# EAGLE design 1s (EAGLE 9.1.1)
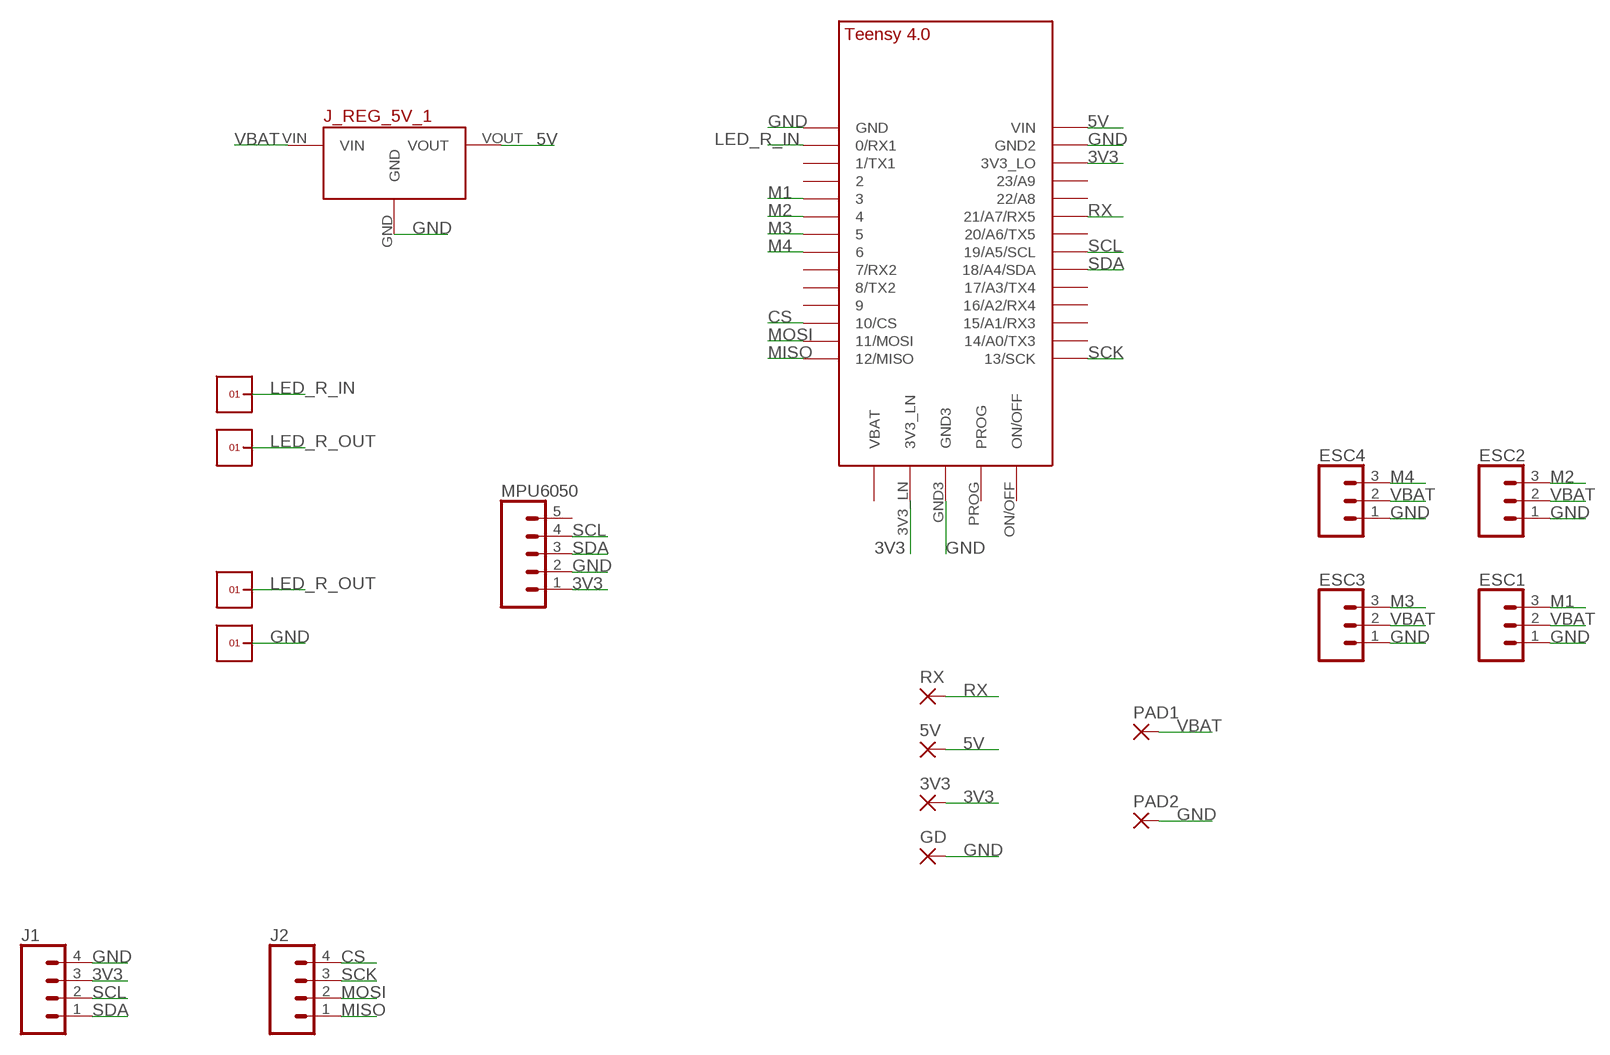
[diagram p0: schematic, sheet 1]

## Parts
3V3  SMD2  [SMD1,27-2,54]
5V  SMD2  [SMD1,27-2,54]
ESC1  455-1750-1-ND  CONN_03  [1X03]
ESC2  455-1750-1-ND  CONN_03  [1X03]
ESC3  455-1750-1-ND  CONN_03  [1X03]
ESC4  455-1750-1-ND  CONN_03  [1X03]
GD  SMD2  [SMD1,27-2,54]
J1  CONN_041X04_NO_SILK  [1X04_NO_SILK]
J2  CONN_041X04_NO_SILK  [1X04_NO_SILK]
J_REG_5V_1  5V_VOLTAGE_REGULATOR  [5V_VOLTAGE_REGULATOR]
MPU6050  CONN_05NO_SILK  [1X05_NO_SILK]
PAD1  SMD5  [SMD2,54-5,08]
PAD2  SMD5  [SMD2,54-5,08]
RX  SMD2  [SMD1,27-2,54]
U$1  TEENSY_4.0  [TEENSY_4.0]
U$3  1X1  [1X1]
U$4  1X1  [1X1]
U$6  1X1  [1X1]
U$7  1X1  [1X1]

## Nets
3V3: 3V3.1(P) J1.3 MPU6050.1 U$1.3V3_LN U$1.3V3_LO
5V: 5V.1(P) J_REG_5V_1.VOUT U$1.VIN
CS: J2.4 U$1.10/CS
GND: ESC1.1 ESC2.1 ESC3.1 ESC4.1 GD.1(P) J1.4 J_REG_5V_1.GND MPU6050.2 PAD2.1(P) U$1.GND U$1.GND2 U$1.GND3 U$7.1
LED_R_IN: U$1.0/RX(0/RX1) U$3.1
LED_R_OUT: U$4.1 U$6.1
M1: ESC1.3 U$1.3/CANTX
M2: ESC2.3 U$1.4/CANRX
M3: ESC3.3 U$1.5
M4: ESC4.3 U$1.6
MISO: J2.1 U$1.12/MISO
MOSI: J2.2 U$1.11/MOSI
RX: RX.1(P) U$1.21/A7(21/A7/RX5)
SCK: J2.3 U$1.13/SCK
SCL: J1.2 MPU6050.4 U$1.19/A5/SCL
SDA: J1.1 MPU6050.3 U$1.18/A4/SDA
VBAT: ESC1.2 ESC2.2 ESC3.2 ESC4.2 J_REG_5V_1.VIN PAD1.1(P)
Unconnected: MPU6050.5 U$1.1/TX(1/TX1) U$1.2 U$1.7(7/RX2) U$1.8(8/TX2) U$1.9/CS U$1.14/A0(14/A0/TX3) U$1.15/A1(15/A1/RX3) U$1.16/A2(16/A2/RX4) U$1.17/A3(17/A3/TX4) U$1.20/A6(20/A6/TX5) U$1.22/A8 U$1.23/A9 U$1.ON/OFF U$1.PROG U$1.VBAT\(VBAT)

## Library data of the parts
3V3 5V GD RX = wirepad:SMD2: SMD PAD
ESC1-ESC4 = SparkFun-Connectors:CONN_03: Multi connection point. Often used as Generic Header-pin footprint for 0.1 inch spaced/style header connections On any of the 0.1 inch spaced packages, you can populate with these: Break Away Headers - Straight <https://www.sparkfun.com/products/116> (PRT-00116) Break Away Male Headers - Right Angle <https://www.sparkfun.com/products/553> (PRT-00553) Female Headers <https://www.sparkfun.com/products/115> (PRT-00115) Break Away Headers - Machine Pin <https://www.sparkfun.com/products/117> (PRT-00117) Break Away Female Headers - Swiss Machine Pin <https://www.sparkfun.com/products/743> (PRT-00743) Stackable Header - 3 Pin (Female, 0.1") <https://www.sparkfun.com/products/13875> (PRT-13875) For SCREWTERMINALS and SPRING TERMINALS visit here: Screw Terimnals on SparkFun.com <https://www.sparkfun.com/search/results?term=Screw+Terminals> (5mm/3.5mm/2.54mm spacing) This device is also useful as a general connection point to wire up your design to another part of your project. Our various solder wires solder well into these plated through hole pads. Hook-Up Wire - Assortment (Stranded, 22 AWG) <https://www.sparkfun.com/products/11375> (PRT-11375) Hook-Up Wire - Assortment (Solid Core, 22 AWG) <https://www.sparkfun.com/products/11367> (PRT-11367) View the entire wire category on our website here <https://www.sparkfun.com/categories/141> Special notes: Molex polarized connector foot print use with SKU : PRT-08232 with associated crimp pins and housings.; PROD_ID: XXX-00000
J1 J2 = SparkFun-Connectors:CONN_04: Multi connection point. Often used as Generic Header-pin footprint for 0.1 inch spaced/style header connections On any of the 0.1 inch spaced packages, you can populate with these: Break Away Headers - Straight <https://www.sparkfun.com/products/116> (PRT-00116) Break Away Male Headers - Right Angle <https://www.sparkfun.com/products/553> (PRT-00553) Female Headers <https://www.sparkfun.com/products/115> (PRT-00115) Break Away Headers - Machine Pin <https://www.sparkfun.com/products/117> (PRT-00117) Break Away Female Headers - Swiss Machine Pin <https://www.sparkfun.com/products/743> (PRT-00743) For SCREWTERMINALS and SPRING TERMINALS visit here: Screw Terimnals on SparkFun.com <https://www.sparkfun.com/search/results?term=Screw+Terminals> (5mm/3.5mm/2.54mm spacing) This device is also useful as a general connection point to wire up your design to another part of your project. Our various solder wires solder well into these plated through hole pads. Hook-Up Wire - Assortment (Stranded, 22 AWG) <https://www.sparkfun.com/products/11375> (PRT-11375) Hook-Up Wire - Assortment (Solid Core, 22 AWG) <https://www.sparkfun.com/products/11367> (PRT-11367) View the entire wire category on our website here <https://www.sparkfun.com/categories/141> Special notes: Molex polarized connector foot print use with SKU : PRT-08231 with associated crimp pins and housings. 1MM SMD Version SKU: PRT-10208; PROD_ID: CONN-09696
J_REG_5V_1 = Pololu Voltage Regulators:5V_VOLTAGE_REGULATOR: Polulu 5V Step-Up/Step-Down Voltage REgulator S7V7F5
MPU6050 = SparkFun-Connectors:CONN_05: Multi connection point. Often used as Generic Header-pin footprint for 0.1 inch spaced/style header connections On any of the 0.1 inch spaced packages, you can populate with these: Break Away Headers - Straight <https://www.sparkfun.com/products/116> (PRT-00116) Break Away Male Headers - Right Angle <https://www.sparkfun.com/products/553> (PRT-00553) Female Headers <https://www.sparkfun.com/products/115> (PRT-00115) Break Away Headers - Machine Pin <https://www.sparkfun.com/products/117> (PRT-00117) Break Away Female Headers - Swiss Machine Pin <https://www.sparkfun.com/products/743> (PRT-00743) For SCREWTERMINALS and SPRING TERMINALS visit here: Screw Terimnals on SparkFun.com <https://www.sparkfun.com/search/results?term=Screw+Terminals> (5mm/3.5mm/2.54mm spacing) This device is also useful as a general connection point to wire up your design to another part of your project. Our various solder wires solder well into these plated through hole pads. Hook-Up Wire - Assortment (Stranded, 22 AWG) <https://www.sparkfun.com/products/11375> (PRT-11375) Hook-Up Wire - Assortment (Solid Core, 22 AWG) <https://www.sparkfun.com/products/11367> (PRT-11367) View the entire wire category on our website here <https://www.sparkfun.com/categories/141> Special notes: Molex polarized connector foot print use with SKU : PRT-08231 with associated crimp pins and housings. 1MM SMD Version SKU: PRT-10208
PAD1 PAD2 = wirepad:SMD5: SMD PAD
U$1 = TEENSY 4.0:TEENSY_4.0
U$3 U$4 U$6 U$7 = headers(2mm):1X1

## Board
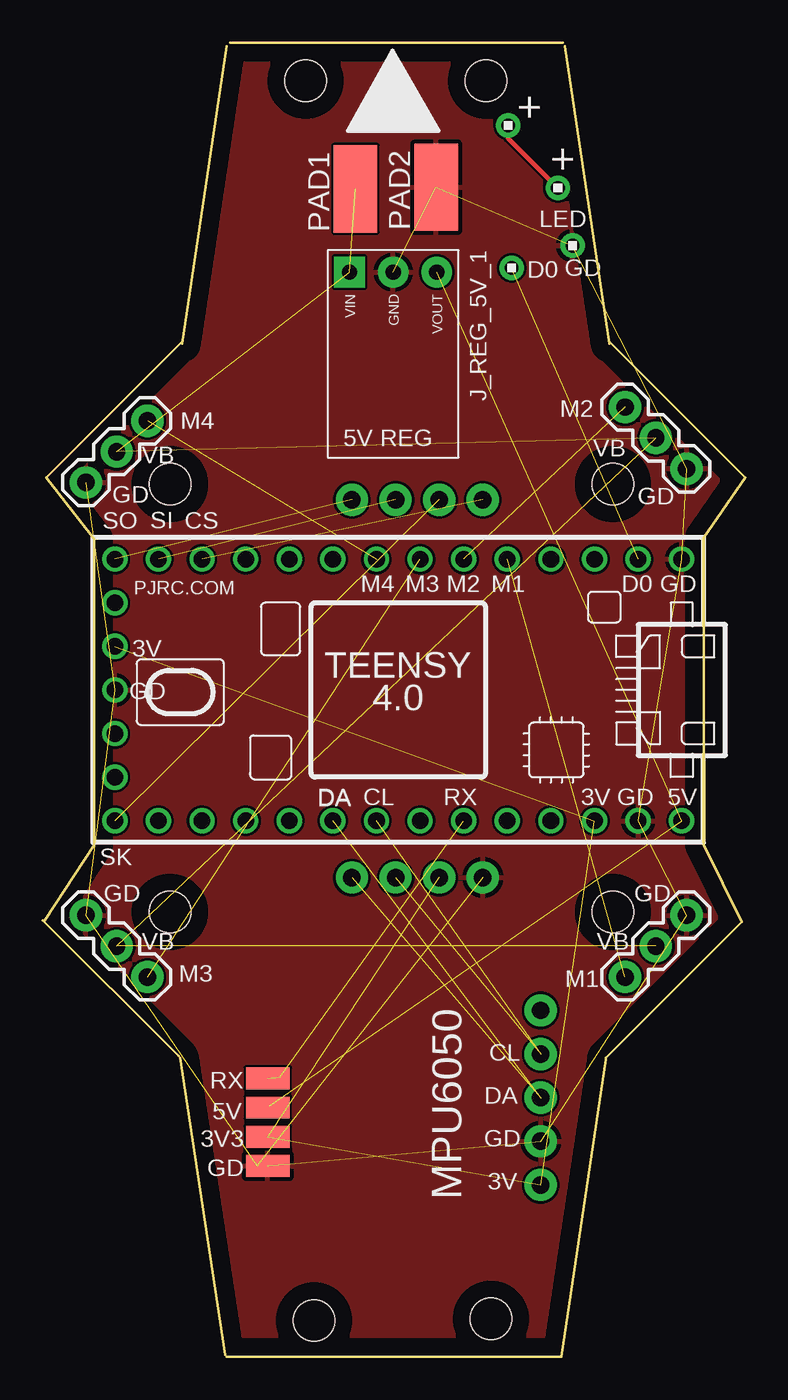
[diagram p1: board, top side]

Size 40.9 x 76.5 mm. Coordinates in mm from the lower left corner, seen from the top.
Outline: 38.5,47.6 38.5,29.9
Outline: 10.9,76.5 30.3,76.5
Outline: 10.7,0 30.1,0
Outline: 8,17.4 10.6,0.1
Outline: 32.8,17.3 30.2,0
Outline: 32.8,17.4 40.7,25.3 38.5,29.8
Outline: 0.1,25.4 3,29.8 3,47.6 0.2,51.2 8.1,59.1
Outline: 7.9,17.5 0,25.4
Outline: 33,59.1 40.9,51.2 38.5,47.7
Outline: 10.7,76.3 8.1,59
Outline: 30.4,76.3 33,59
Copper layers (1*16): Top 0.035mm / dielectric 1.5mm / Bottom 0.035mm
Design rules "default": minimum track width 6mil, minimum drill 0.35mm, track to track 6mil, track to pad 6mil, pad to pad 6mil, via to via 6mil, smd to smd 6mil, copper to edge 40mil, drill to drill 6mil, minimum pad ring 10mil, minimum via ring 8mil, stop-mask expansion 4mil, vias tented up to drill 0mil, thermal gap 10mil
Holes 2.4 mm at 15.3,74.3 25.8,74.3 15.8,2.1 26.1,2.2 33.2,50.8 7.4,50.8 7.4,25.9 33.2,25.9

### Footprints (pad centres in the part's own frame; a part is rotated, then mirrored left to right if it is on the bottom)
SMD1,27-2,54 = smd 1.27 x 2.54: 1 0,0
1X03 = drill 1.016 pad 1.88: 1 0,0; 2 2.54,0; 3 5.08,0
1X04_NO_SILK = drill 1.016 pad 1.88: 1 0,0; 2 2.54,0; 3 5.08,0; 4 7.62,0
5V_VOLTAGE_REGULATOR = drill 0.9 pad 1.778: GND 0,-6.35; VOUT -2.54,-6.35 | drill 0.9 pad 1.778 square: VIN 2.54,-6.35
1X05_NO_SILK = drill 1.016 pad 1.88: 1 0,0; 2 2.54,0; 3 5.08,0; 4 7.62,0; 5 10.16,0
SMD2,54-5,08 = smd 2.54 x 5.08: 1 0,0
TEENSY_4.0 = drill 0.965: 0/RX -13.97,-7.62; 1/TX -11.43,-7.62; 2 -8.89,-7.62; 3/CANTX -6.35,-7.62; 3V3_LN 16.51,-2.54; 3V3_LO -11.43,7.62; 4/CANRX -3.81,-7.62; 5 -1.27,-7.62; 6 1.27,-7.62; 7 3.81,-7.62; 8 6.35,-7.62; 9/CS 8.89,-7.62; 10/CS 11.43,-7.62; 11/MOSI 13.97,-7.62; 12/MISO 16.51,-7.62; 13/SCK 16.51,7.62; 14/A0 13.97,7.62; 15/A1 11.43,7.62; 16/A2 8.89,7.62; 17/A3 6.35,7.62; 18/A4/SDA 3.81,7.62; 19/A5/SCL 1.27,7.62; 20/A6 -1.27,7.62; 21/A7 -3.81,7.62; 22/A8 -6.35,7.62; 23/A9 -8.89,7.62; GND -16.51,-7.62; GND2 -13.97,7.62; GND3 16.51,0; ON/OFF 16.51,5.08; PROG 16.51,2.54; VBAT\ 16.51,-5.08; VIN -16.51,7.62
1X1 = drill 0.8 pad 1.422: 1 0,0

### Placement (x,y rotation side)
3V3  13.1,12.8 90 top
5V  13.1,14.5 90 top
ESC1  37.5,25.7 225 top
ESC2  37.5,51.7 135 top
ESC3  2.5,25.7 315 top
ESC4  2.5,50.9 45 top
GD  13.1,11.1 90 top
J1  18,27.9 0 top
J2  18,49.9 0 top
J_REG_5V_1  20.4,56.8 180 top
MPU6050  29,10 90 top
PAD1  18.2,68 0 top
PAD2  22.9,68.1 0 top
RX  13.1,16.2 90 top
U$1  20.7,38.82 180 top
U$3  27.3,63.4 0 top
U$4  27.1,71.7 0 top
U$6  30,68.05 0 top
U$7  30.85,64.7 0 top

### Tracks (layer width: path | path; a pad name or v marks a point on that pad's centre or on a via)
3V3  (4 unrouted)
5V  (2 unrouted)
  Top 0.305: 13.2,14.6 5V.1
CS  (1 unrouted)
GND  (12 unrouted)
  Top 0.305: GD.1 12.46,11.1
  pour Top: 54.25,80.16 54.25,-1.35 -14.2,-1.35 -14.2,80.16
LED_R_IN  (1 unrouted)
LED_R_OUT
  Top 0.254: U$4.1 27.1,70.95 U$6.1
M1  (1 unrouted)
M2  (1 unrouted)
M3  (1 unrouted)
M4  (1 unrouted)
MISO  (1 unrouted)
MOSI  (1 unrouted)
RX  (2 unrouted)
  Top 0.254: 13.9,16.2 13.8,16.3
SCK  (1 unrouted)
SCL  (2 unrouted)
SDA  (2 unrouted)
VBAT  (5 unrouted)

### Text on the board
tNames: + | + | LED | D0 | GD | M2 | M4 | VB | VB | GD | GD | SO | SI | CS | M4 | M3 | M2 | M1 | D0 | GD | 3V | GD | DA | DA | CL | RX | 3V | GD | 5V | SK | GD | GD | VB | VB | M3 | M1 | MPU6050 | CL | DA | GD | 3V
bNames: RES